# EAGLE design E3-Thermal_Sensor_v2 (EAGLE 7.7.0)
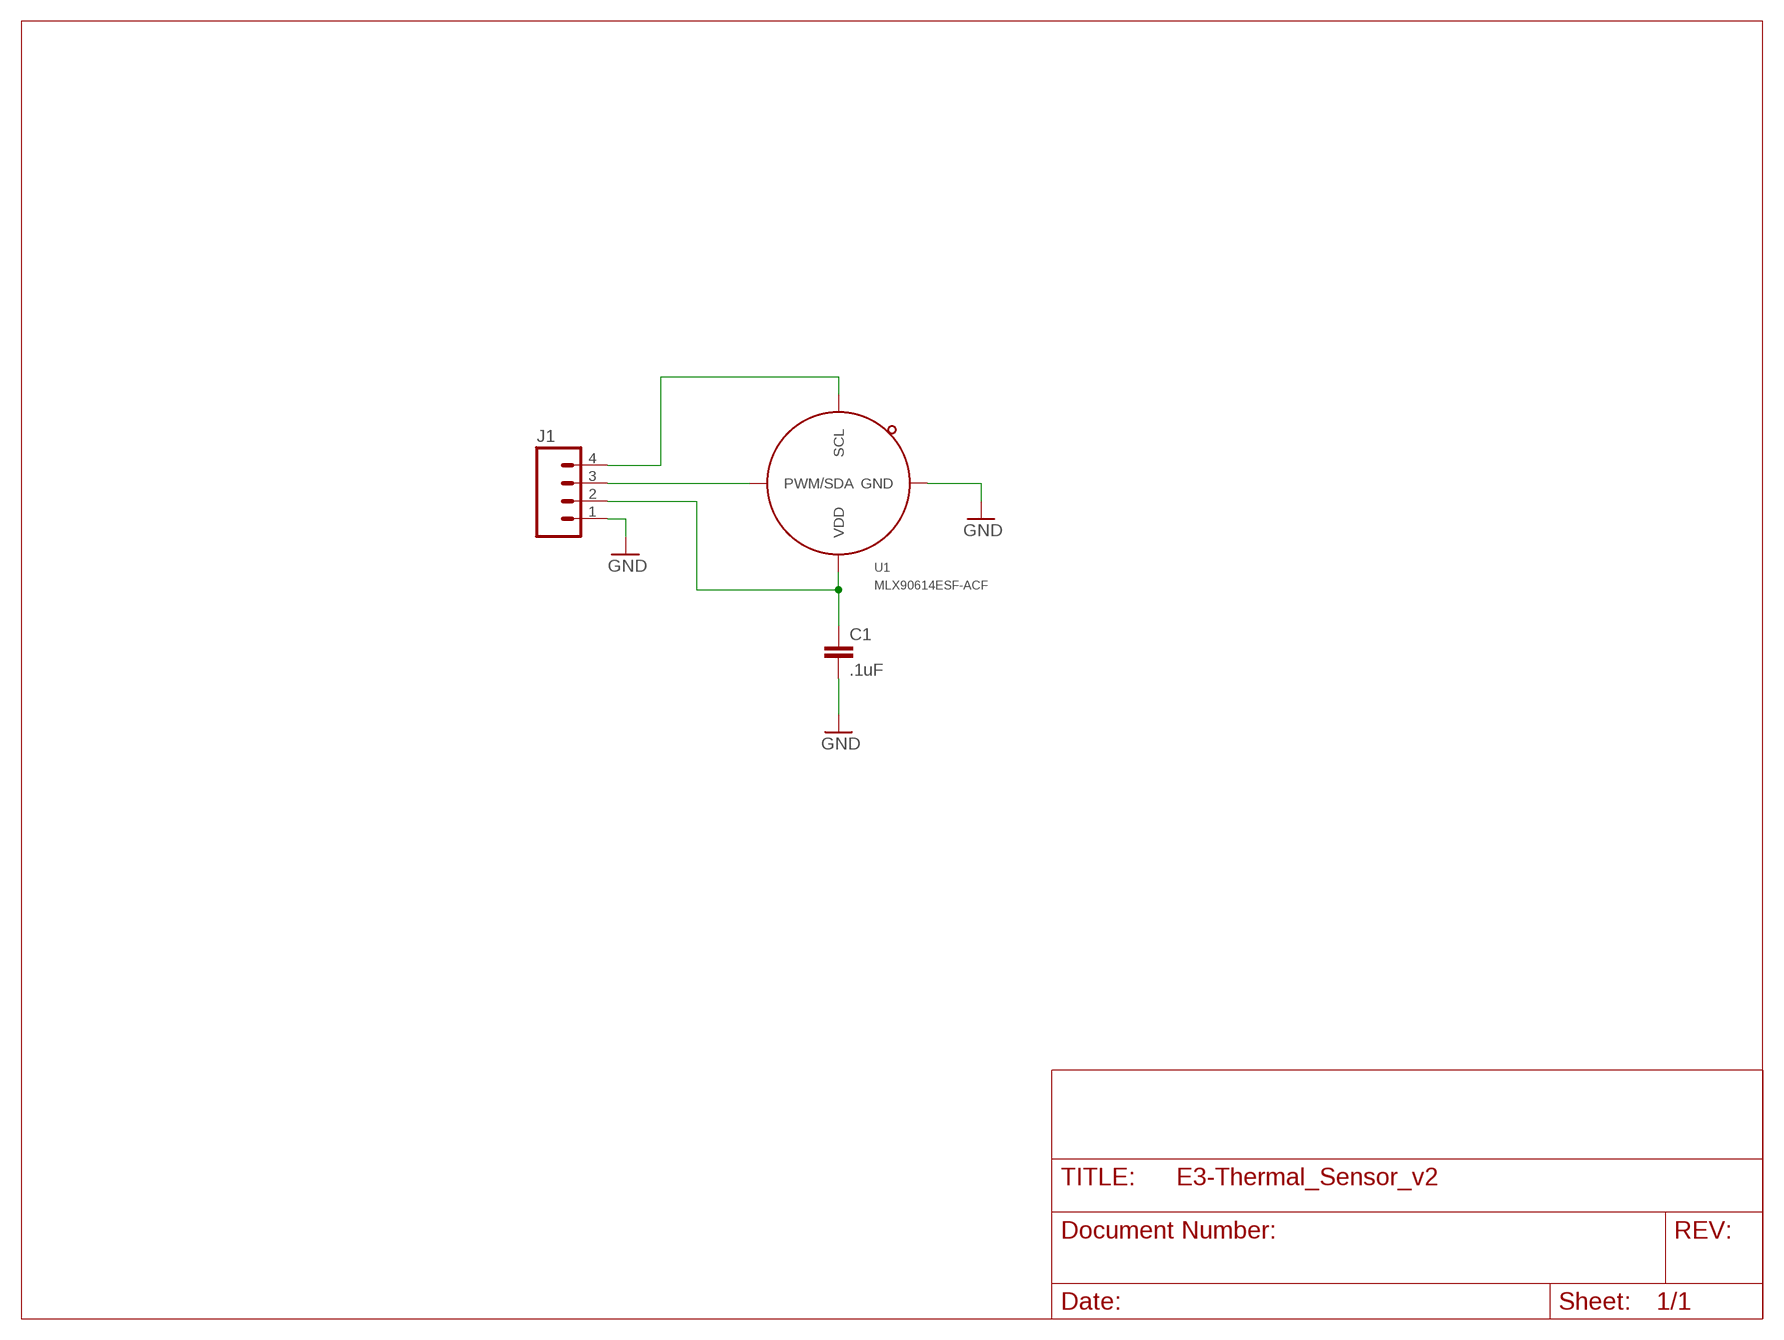
[diagram p0: schematic, sheet 1]

## Parts
C1  .1uF  CAP0603-CAP  [0603-CAP]
J1  M04PTH  [1X04]
U1  MLX90614ESF-ACF  [MLX90614XCF]

## Nets
GND: C1.2 J1.1 U1.P4(GND)
N$1: C1.1 J1.2 U1.P3(VDD)
N$2: J1.3 U1.P2(PWM/SDA)
N$3: J1.4 U1.P1(SCL)

## Library data of the parts
C1 = SparkFun-Passives:CAP: Capacitor Standard 0603 ceramic capacitor, and 0.1" leaded capacitor.
J1 = SparkFun-Connectors:M04: Header 4 Standard 4-pin 0.1" header. Use with straight break away headers (SKU : PRT-00116), right angle break away headers (PRT-00553), swiss pins (PRT-00743), machine pins (PRT-00117), and female headers (PRT-00115). Molex polarized connector foot print use with SKU : PRT-08231 with associated crimp pins and housings. 1MM SMD Version SKU: PRT-10208; PROD_ID: CONN-09696
U1 = MLX90614:MLX90614ESF-ACF: Melexis MLX90614 Infra Red Thermometer

## Board
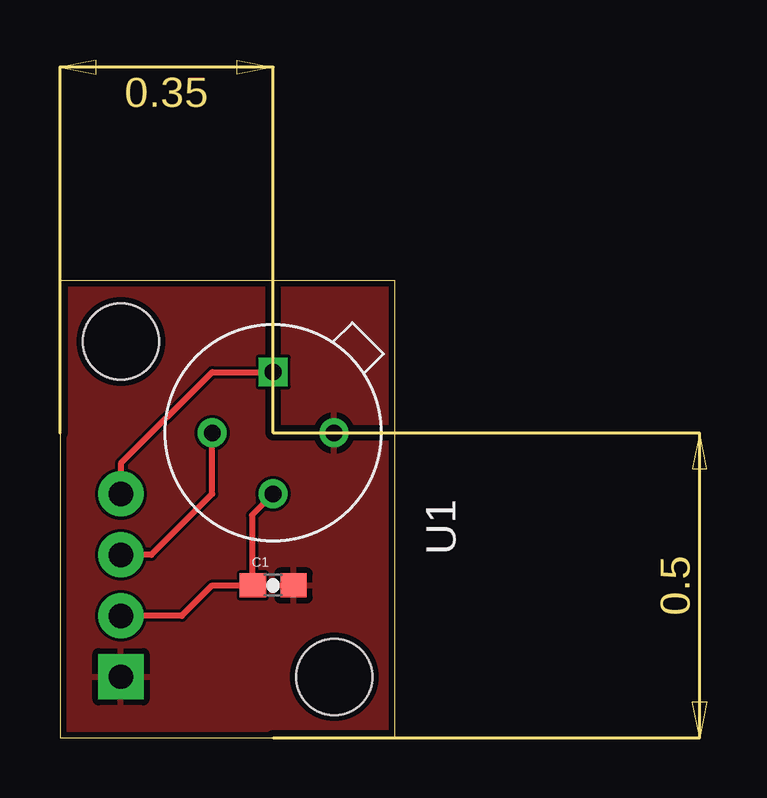
[diagram p1: board, top side]
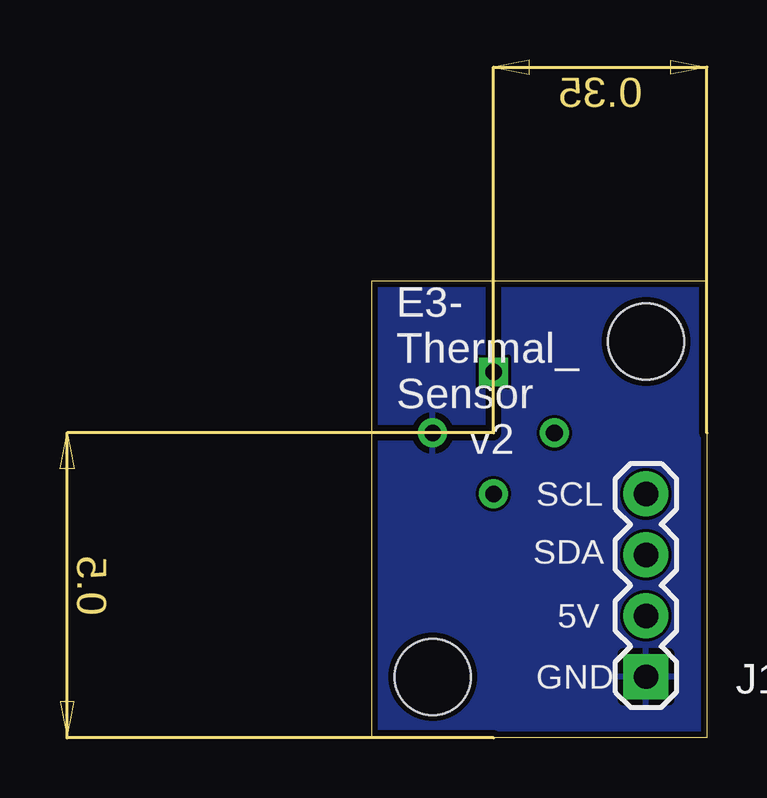
[diagram p2: board, bottom side, seen from below]

Size 13.97 x 19.05 mm. Coordinates in mm from the lower left corner, seen from the top.
Outline: 0,0 8.89,0 13.97,0 13.97,19.05 0,19.05 0,12.7 0,0
Copper layers (1*16): Top 0.035mm / dielectric 1.5mm / Bottom 0.035mm
Design rules "dirt_cheap_dirty_boards.v1": minimum track width 5mil, minimum drill 12mil, track to track 5mil, track to pad 5mil, pad to pad 5mil, via to via 5mil, smd to smd 0mil, copper to edge 10mil, drill to drill 10mil, minimum pad ring 10mil, minimum via ring 6mil, stop-mask expansion 2mil, vias tented up to drill 25mil, thermal gap 10mil
Holes 3.17 mm at 11.43,2.54 2.54,16.51

### Footprints (pad centres in the part's own frame; a part is rotated, then mirrored left to right if it is on the bottom)
0603-CAP = smd 1.1 x 1: 1 -0.85,0; 2 0.85,0
1X04 = drill 1.016 pad 1.88 square: 1 0,0 | drill 1.016 pad 1.88: 2 2.54,0; 3 5.08,0; 4 7.62,0
MLX90614XCF = drill 0.7 square: P1 2.54,0 | drill 0.7: P2 0,2.54; P3 -2.54,0; P4 0,-2.54

### Placement (x,y rotation side)
C1  8.89,6.35 0 top
J1  2.54,2.54 90 bottom
U1  8.89,12.7 90 top

### Tracks (layer width: path | path; a pad name or v marks a point on that pad's centre or on a via)
GND
  pour Top: 0,0 0,19.05 13.97,19.05 13.97,0
  pour Bottom: 0,0 0,19.05 13.97,19.05 13.97,0
N$1
  Top 0.254: U1.P3 8,9.27 8,6.39 C1.1 6.35,6.35 5.08,5.08 J1.2
N$2
  Top 0.254: U1.P2 6.35,10.16 3.81,7.62 J1.3
N$3
  Top 0.254: U1.P1 6.35,15.24 2.54,11.43 J1.4

### Text on the board
bPlace: E3- / Thermal_ / Sensor | v2 | SCL | SDA | 5V | GND